# Altium schematic sheet eps_pex.SchDoc
size A4
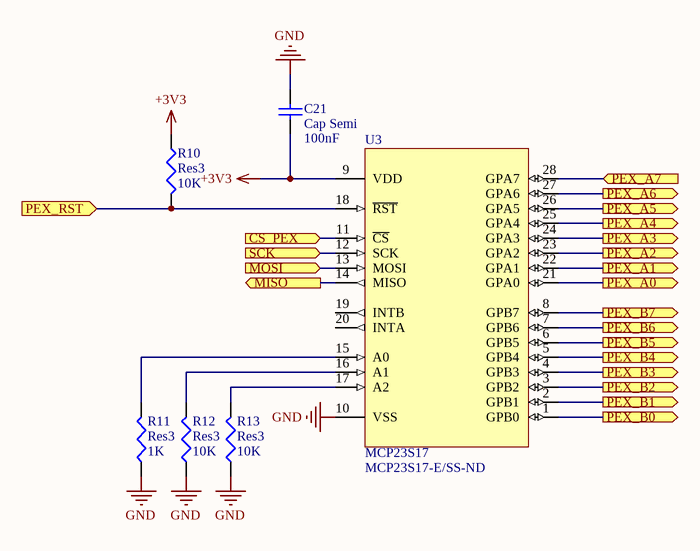
[diagram p0: eps_pex.SchDoc]

## Parts
C21  Cap Semi  value 100nF  [1608[0603]]
R10  Res3  value 10K  [J1-0603]
R11  Res3  value 1K  [J1-0603]
R12  Res3  value 10K  [J1-0603]
R13  Res3  value 10K  [J1-0603]
U3  MCP23S17  Supplier Part Number 1: MCP23S17-E/SS-ND  [SOP65P780X200-28N]

## Ports
CS_PEX (in), MISO (out), MOSI (in), PEX_A0 (out), PEX_A1 (out), PEX_A2 (out), PEX_A3 (out), PEX_A4 (out), PEX_A5 (out), PEX_A6 (out), PEX_A7 (in), PEX_B0 (out), PEX_B1 (out), PEX_B2 (out), PEX_B3 (out), PEX_B4 (out), PEX_B5 (out), PEX_B6 (out), PEX_B7 (out), PEX_RST (in), SCK (in)

## Nets
+3V3: C21.2 R10.1 U3.9(VDD)
GND: C21.1 R11.1 R12.1 R13.1 U3.10(VSS)
CS_PEX: U3.11(~{CS}) ; port CS_PEX
MISO: U3.14(MISO) ; port MISO
MOSI: U3.13(MOSI) ; port MOSI
PEX_A0: U3.21(GPA0) ; port PEX_A0
PEX_A1: U3.22(GPA1) ; port PEX_A1
PEX_A2: U3.23(GPA2) ; port PEX_A2
PEX_A3: U3.24(GPA3) ; port PEX_A3
PEX_A4: U3.25(GPA4) ; port PEX_A4
PEX_A5: U3.26(GPA5) ; port PEX_A5
PEX_A6: U3.27(GPA6) ; port PEX_A6
PEX_A7: U3.28(GPA7) ; port PEX_A7
PEX_B0: U3.1(GPB0) ; port PEX_B0
PEX_B1: U3.2(GPB1) ; port PEX_B1
PEX_B2: U3.3(GPB2) ; port PEX_B2
PEX_B3: U3.4(GPB3) ; port PEX_B3
PEX_B4: U3.5(GPB4) ; port PEX_B4
PEX_B5: U3.6(GPB5) ; port PEX_B5
PEX_B6: U3.7(GPB6) ; port PEX_B6
PEX_B7: U3.8(GPB7) ; port PEX_B7
PEX_RST: R10.2 U3.18(~{RST}) ; port PEX_RST
SCK: U3.12(SCK) ; port SCK
NetR11_2: R11.2 U3.15(A0)
NetR12_2: R12.2 U3.16(A1)
NetR13_2: R13.2 U3.17(A2)

Not connected (* = marked no-connect by the designer): U3 19(INTB) 20(INTA)

## Library data of the parts
C21 = Cap Semi: Capacitor (Semiconductor SIM Model); Published: 8-Jun-2000; LatestRevisionDate: 29-May-2009; LatestRevisionNote: IPC-7351 Footprint Added.; PackageReference: C1206; Publisher: Altium Limited; PackageDescription: Chip Capacitor
R10-R13 = Res3: Resistor; Published: 8-Jun-2000; LatestRevisionDate: 29-May-2009; LatestRevisionNote: IPC-7351 Footprint Added.; PackageReference: J1-0603; Publisher: Altium Limited; PackageDescription: Chip Resistor
U3 = MCP23S17: 16 bit I/O expander with SPI interface.; Supplier 1: Digi-Key